# Altium schematic sheet MCU.SchDoc: =ProjectName
size A4; CheckedBy: DatNB; Author: Ven; CompanyName: Nacentech; Organization: IMET
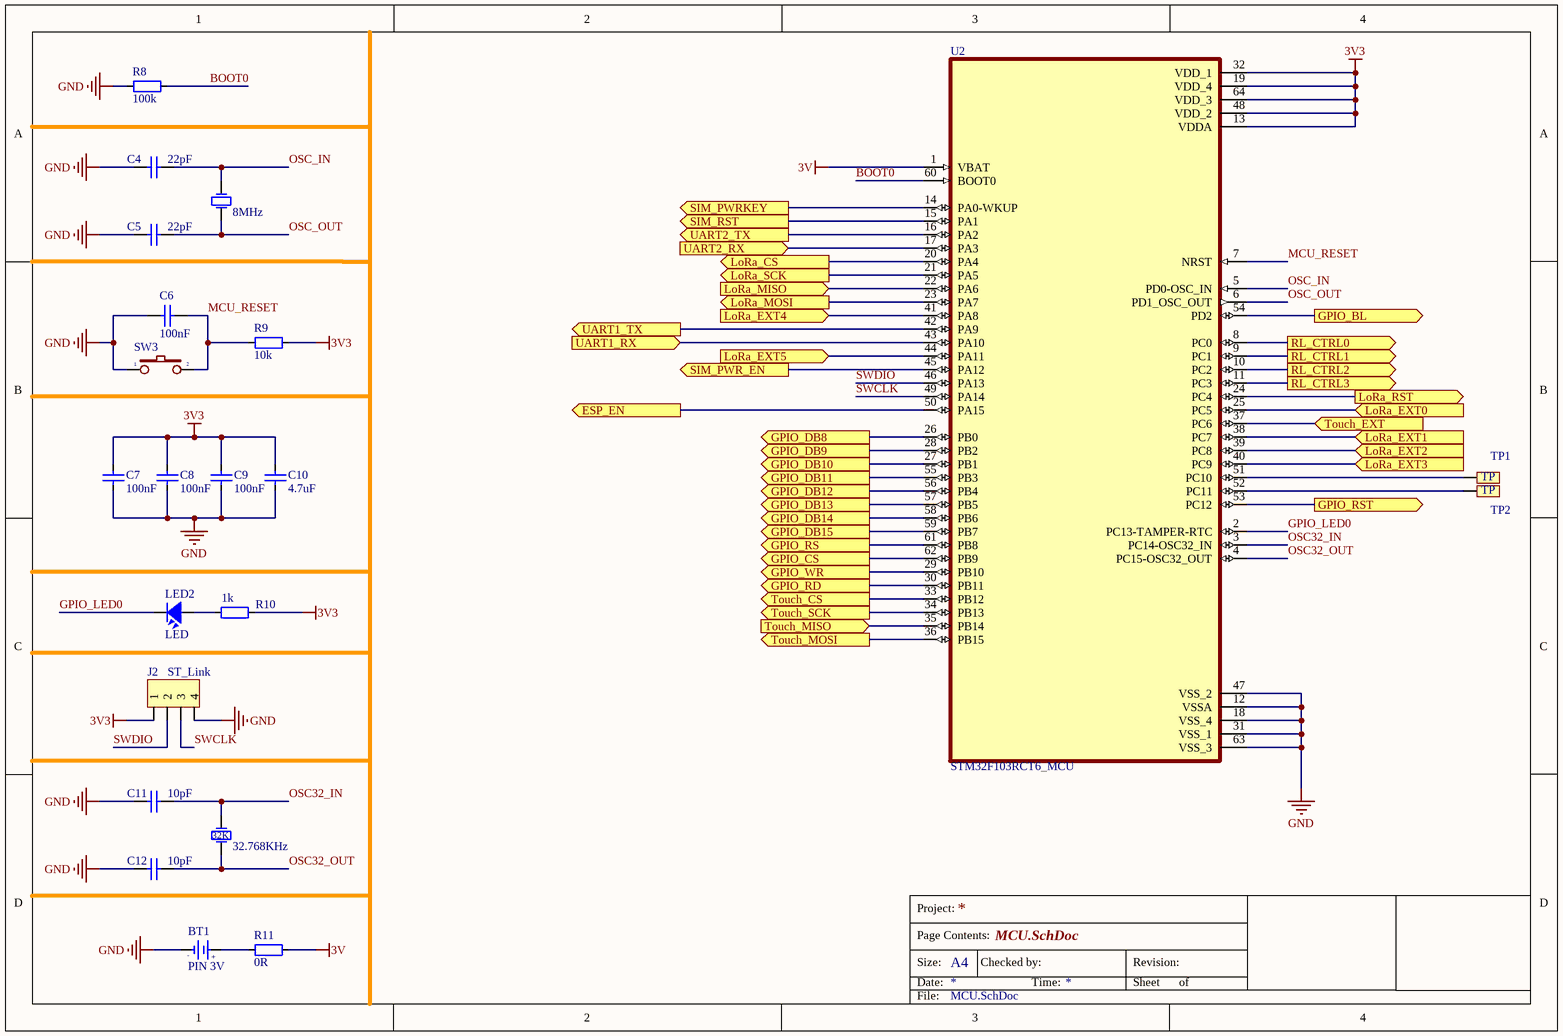
[diagram p0: MCU.SchDoc]

## Parts
BT1  PIN 3V  [CR1220 SMD]
C4  22pF  [CAP_0805]
C5  22pF  [CAP_0805]
C6  100nF  [CAP_0805]
C7  100nF  [CAP_0805]
C8  100nF  [CAP_0805]
C9  100nF  [CAP_0805]
C10  4.7uF  [CAP_0805]
C11  10pF  [CAP_0805]
C12  10pF  [CAP_0805]
J2  ST_Link  [Header4 - SMD 1.25mm - B]
LED2  LED  [LED-0805-Green]
R8  100k  [RES-SMD-0805]
R9  10k  [RES-SMD-0805]
R10  1k  [RES-SMD-0805]
R11  0R  [RES-SMD-0805]
SW3  SW  [SW 3x2x4]  (value not drawn)
TP1  (no value)  [TP_SMD]
TP2  (no value)  [TP_SMD]
U2  STM32F103RCT6_MCU  [LQFP 64]
Y1  8MHz  [XTAL]
Y2  32.768KHz  [XTAL32K]

## Ports
ESP_EN (out), GPIO_BL (out), GPIO_CS (out), GPIO_DB8 (out), GPIO_DB9 (out), GPIO_DB10 (out), GPIO_DB11 (out), GPIO_DB12 (out), GPIO_DB13 (out), GPIO_DB14 (out), GPIO_DB15 (out), GPIO_RD (out), GPIO_RS (out), GPIO_RST (out), GPIO_WR (out), LoRa_CS (out), LoRa_EXT0 (in), LoRa_EXT1 (in), LoRa_EXT2 (in), LoRa_EXT3 (in), LoRa_EXT4 (in), LoRa_EXT5 (in), LoRa_MISO (in), LoRa_MOSI (out), LoRa_RST (out), LoRa_SCK (out), RL_CTRL0 (out), RL_CTRL1 (out), RL_CTRL2 (out), RL_CTRL3 (out), SIM_PWR_EN (out), SIM_PWRKEY (out), SIM_RST (out), Touch_CS (out), Touch_EXT (in), Touch_MISO (in), Touch_MOSI (out), Touch_SCK (out), UART1_RX (in), UART1_TX (out), UART2_RX (in), UART2_TX (out)

## Nets
3V: R11.1 U2.1(VBAT)
3V3: C7.2 C8.2 C9.2 C10.2 J2.1 R9.1 R10.1 U2.13(VDDA) U2.19(VDD_4) U2.32(VDD_1) U2.48(VDD_2) U2.64(VDD_3)
GND: BT1.2(GND) C4.1 C5.1 C6.1 C7.1 C8.1 C9.1 C10.1 C11.1 C12.1 J2.4 R8.2 SW3.1 U2.12(VSSA) U2.18(VSS_4) U2.31(VSS_1) U2.47(VSS_2) U2.63(VSS_3)
BOOT0: R8.1 U2.60(BOOT0)
ESP_EN: U2.50(PA15) ; port ESP_EN
GPIO_BL: U2.54(PD2) ; port GPIO_BL
GPIO_CS: U2.62(PB9) ; port GPIO_CS
GPIO_DB8: U2.26(PB0) ; port GPIO_DB8
GPIO_DB9: U2.28(PB2) ; port GPIO_DB9
GPIO_DB10: U2.27(PB1) ; port GPIO_DB10
GPIO_DB11: U2.55(PB3) ; port GPIO_DB11
GPIO_DB12: U2.56(PB4) ; port GPIO_DB12
GPIO_DB13: U2.57(PB5) ; port GPIO_DB13
GPIO_DB14: U2.58(PB6) ; port GPIO_DB14
GPIO_DB15: U2.59(PB7) ; port GPIO_DB15
GPIO_LED0: LED2.2 U2.2(PC13-TAMPER-RTC)
GPIO_RD: U2.30(PB11) ; port GPIO_RD
GPIO_RS: U2.61(PB8) ; port GPIO_RS
GPIO_RST: U2.53(PC12) ; port GPIO_RST
GPIO_WR: U2.29(PB10) ; port GPIO_WR
LoRa_CS: U2.20(PA4) ; port LoRa_CS
LoRa_EXT0: U2.25(PC5) ; port LoRa_EXT0
LoRa_EXT1: U2.38(PC7) ; port LoRa_EXT1
LoRa_EXT2: U2.39(PC8) ; port LoRa_EXT2
LoRa_EXT3: U2.40(PC9) ; port LoRa_EXT3
LoRa_EXT4: U2.41(PA8) ; port LoRa_EXT4
LoRa_EXT5: U2.44(PA11) ; port LoRa_EXT5
LoRa_MISO: U2.22(PA6) ; port LoRa_MISO
LoRa_MOSI: U2.23(PA7) ; port LoRa_MOSI
LoRa_RST: U2.24(PC4) ; port LoRa_RST
LoRa_SCK: U2.21(PA5) ; port LoRa_SCK
MCU_RESET: C6.2 R9.2 SW3.2 U2.7(NRST)
OSC32_IN: C11.2 U2.3(PC14-OSC32_IN) Y2.1(OSC1)
OSC32_OUT: C12.2 U2.4(PC15-OSC32_OUT) Y2.2(OSC2)
OSC_IN: C4.2 U2.5(PD0-OSC_IN) Y1.1(OSC1)
OSC_OUT: C5.2 U2.6(PD1_OSC_OUT) Y1.2(OSC2)
RL_CTRL0: U2.8(PC0) ; port RL_CTRL0
RL_CTRL1: U2.9(PC1) ; port RL_CTRL1
RL_CTRL2: U2.10(PC2) ; port RL_CTRL2
RL_CTRL3: U2.11(PC3) ; port RL_CTRL3
SIM_PWR_EN: U2.45(PA12) ; port SIM_PWR_EN
SIM_PWRKEY: U2.14(PA0-WKUP) ; port SIM_PWRKEY
SIM_RST: U2.15(PA1) ; port SIM_RST
SWCLK: J2.3 U2.49(PA14)
SWDIO: J2.2 U2.46(PA13)
Touch_CS: U2.33(PB12) ; port Touch_CS
Touch_EXT: U2.37(PC6) ; port Touch_EXT
Touch_MISO: U2.35(PB14) ; port Touch_MISO
Touch_MOSI: U2.36(PB15) ; port Touch_MOSI
Touch_SCK: U2.34(PB13) ; port Touch_SCK
UART1_RX: U2.43(PA10) ; port UART1_RX
UART1_TX: U2.42(PA9) ; port UART1_TX
UART2_RX: U2.17(PA3) ; port UART2_RX
UART2_TX: U2.16(PA2) ; port UART2_TX
NetBT1_1: BT1.1(+3V) R11.2
NetLED2_1: LED2.1 R10.2
NetTP1_1: TP1.1 U2.51(PC10)
NetTP2_1: TP2.1 U2.52(PC11)

## Notes on the sheet
- Project:
- Page Contents:
- Size:
- Date:
- A4
- Checked by:
- Time:
- Revision:
- Sheet
- of
- File:
- (in symbol PIN 3V) -; +
- (in symbol XTAL/32KHz) 32K

## Library data of the parts
BT1 = PIN 3V: Battery 3VDC; Value: PIN 3V
C4-C12 = CapSMD: Capacitor; Value: 33p; Published: 8-Jun-2000; LatestRevisionDate: 17-Jul-2002; LatestRevisionNote: Re-released for DXP Platform.; PackageReference: RAD-0.3; Publisher: Altium Limited
J2 = Header4: Header IDC, 4 x 1 Pin Vertical 2.54mm Pitch (Non-Boxed, Male); Manufacturer: W¨¹rth Elektronik eiSos GmbH; partNo: 613002143121; ComponentLink1 Description: Manufacturer; ComponentLink2 Description: Datasheet; NoPins: 02; Created Date: 29 March 2013; ComponentLink1URL: http://www.we-online.com; ComponentLink2URL: http://katalog.we-online.de/em/datasheet/6130xx143121.pdf; Created by: Karrer Zheng
LED2 = LED: LED Single colour Green and Red; Value: LED 3 ly Single Colour
R8-R11 = Resistor - SMD: Resistor; Manufacturer: Generic Components; Class: Passive; Published: 08/06/2000; Publisher: Altium Hobart Technology Centre
SW3 = SW2: Switch button 2 pin; Value: SW chip 2 pin
TP1 TP2 = TP: CONNECT 1
U2 = stm32f103rct6
Y1 = XTAL: Crystal Oscillator; Published: 8-Jun-2000; LatestRevisionDate: 17-Jul-2002; LatestRevisionNote: Re-released for DXP Platform.; PackageReference: R38; Publisher: Altium Limited
Y2 = XTAL/32KHz: Crystal Oscillator; Published: 8-Jun-2000; LatestRevisionDate: 17-Jul-2002; LatestRevisionNote: Re-released for DXP Platform.; PackageReference: R38; Publisher: Altium Limited